# EAGLE design brick_i2c_atomosphere (EAGLE 7.3.0)
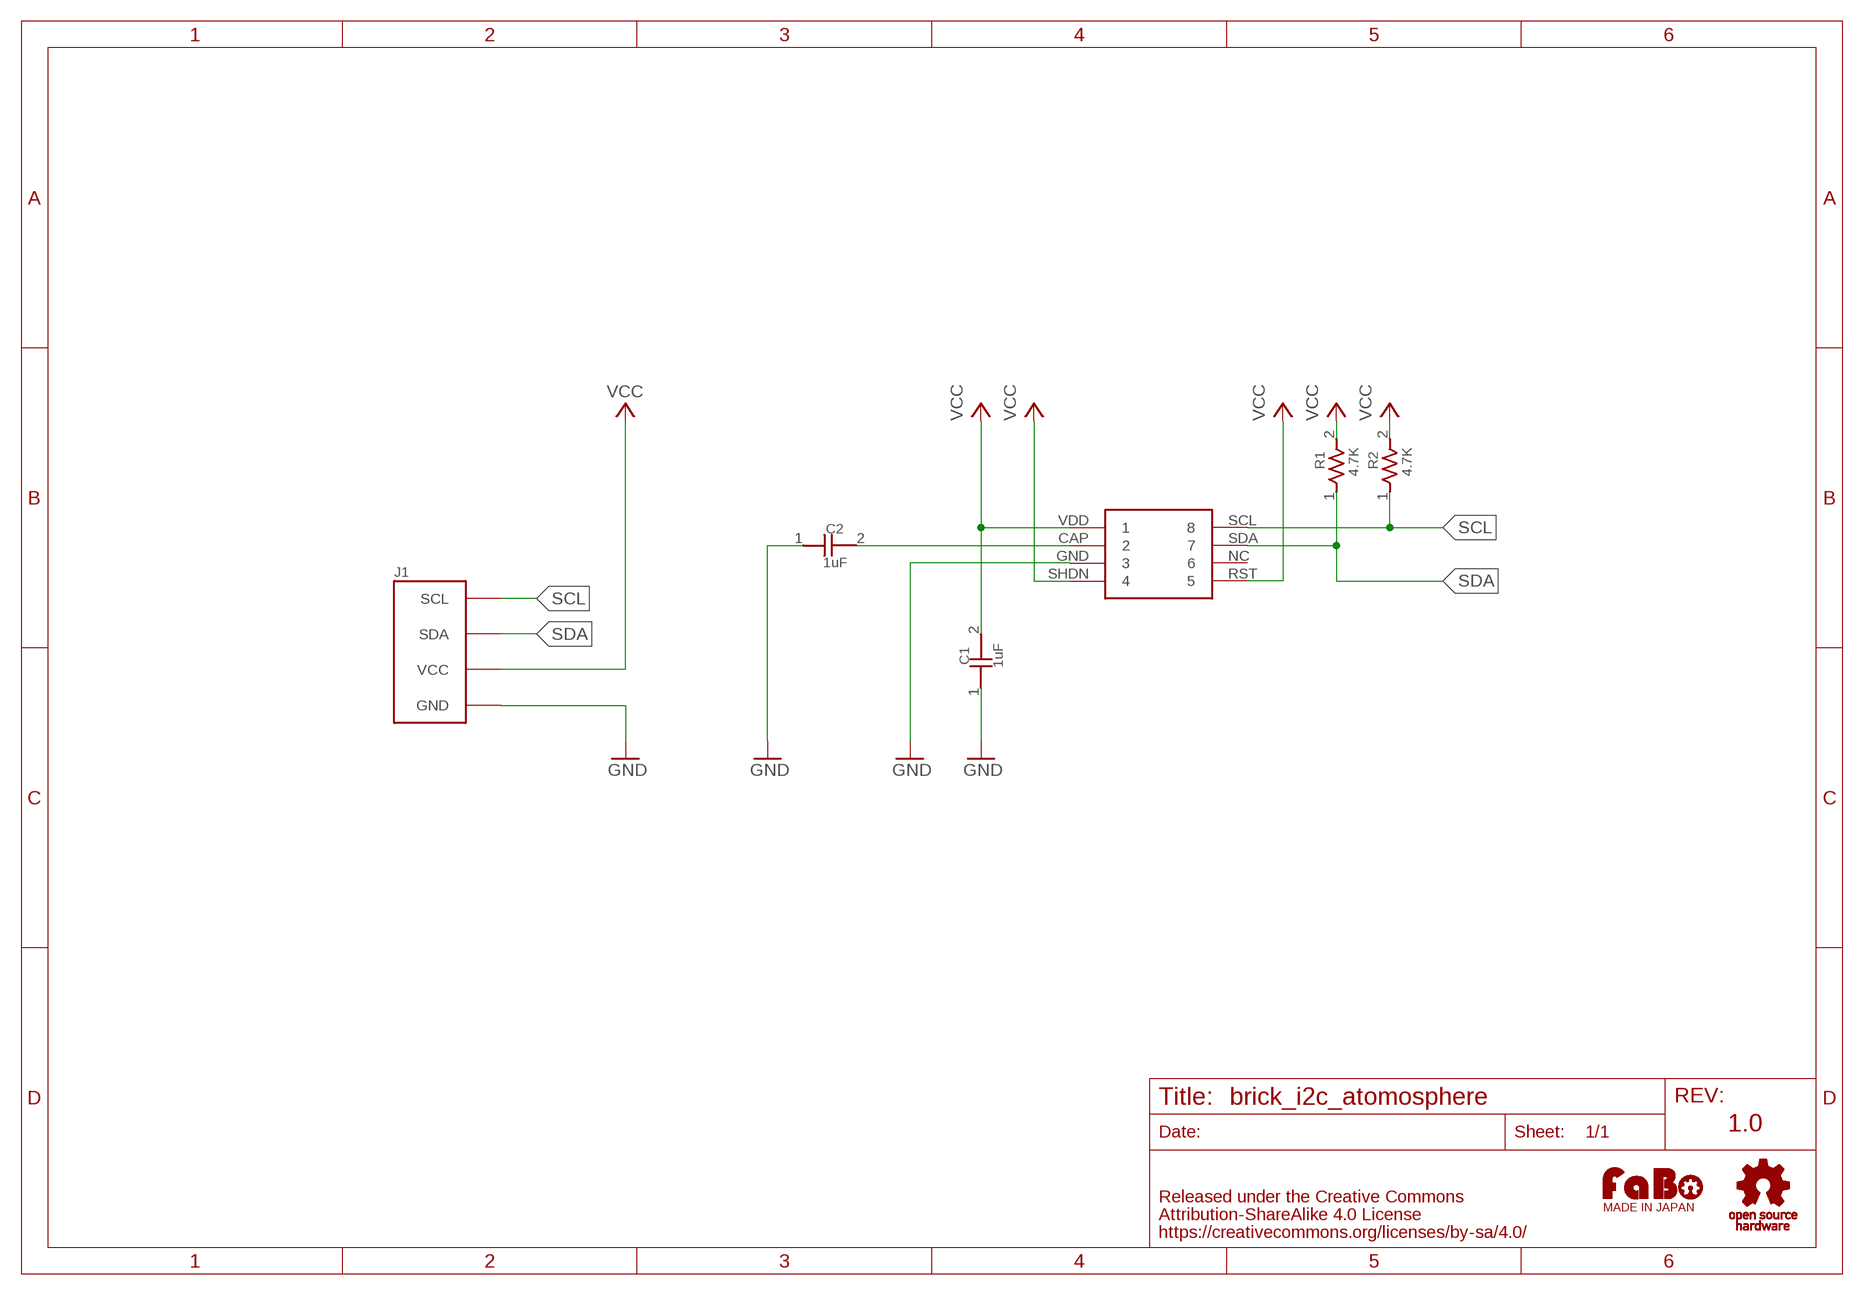
[diagram p0: schematic, sheet 1]

## Parts
C1  1uF  CAPACITOR0603  [0603]
C2  1uF  CAPACITOR0603  [0603]
J1  BRICK_I2C  [BRICK_I2C]
R1  4.7K  RESISTOR0603  [0603]
R2  4.7K  RESISTOR0603  [0603]
U$2  I2C-MPL115A2  [I2C-MLP115A2]
U$3  LOGO_FABO-M  [LOGO_FABO_M]
U$5  LOGO_OSHW_T-M  [LOGO_OSHW_T_M]

## Nets
GND: C1.1 C2.1 J1.GND U$2.GND
N$1: C2.2 U$2.CAP
SCL: J1.SCL R2.1 U$2.SCL
SDA: J1.SDA R1.1 U$2.SDA
VCC: C1.2 J1.VCC R1.2 R2.2 U$2.RST U$2.SHDN U$2.VDD
Unconnected: U$2.NC

## Notes on the sheet
- 1.0

## Library data of the parts
C1 C2 = GClue-Capacitor:CAPACITOR
J1 = gclue:BRICK_I2C: FaBo Brick 4pin(I2C)
R1 R2 = GClue-Resistors:RESISTOR
U$2 = gclue:I2C-MPL115A2
U$3 = FaBo:LOGO_FABO
U$5 = gclue:LOGO_OSHW_T

## Board
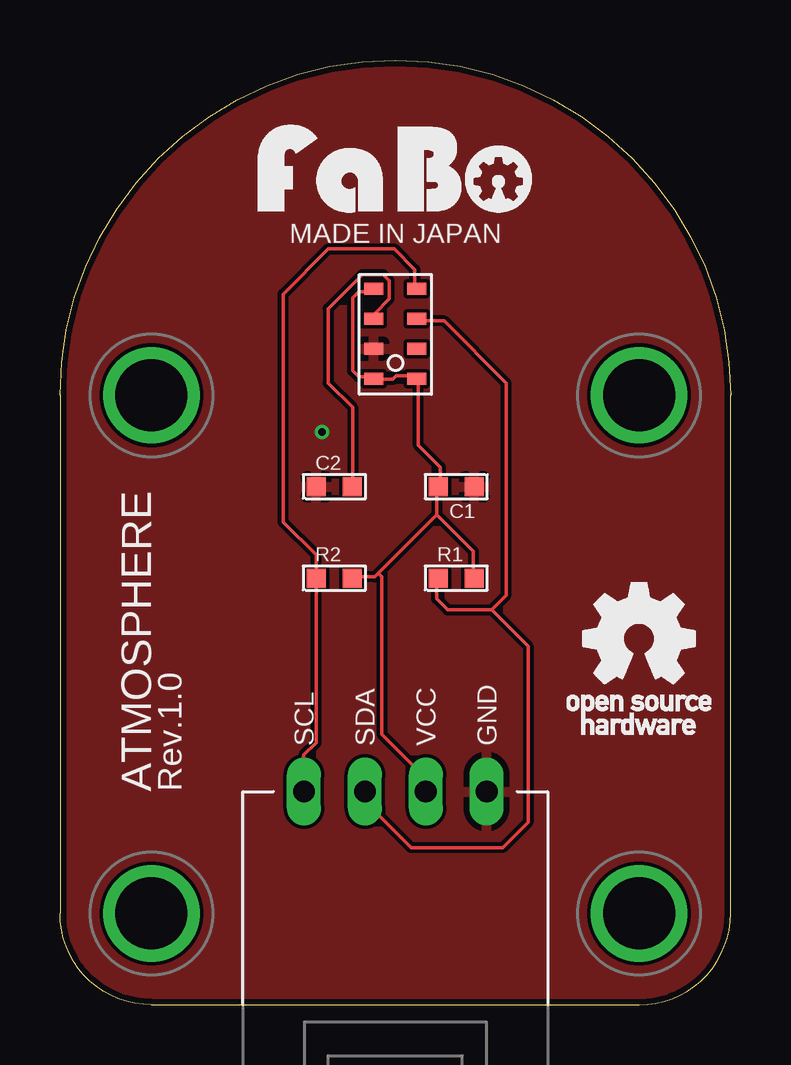
[diagram p1: board, top side]
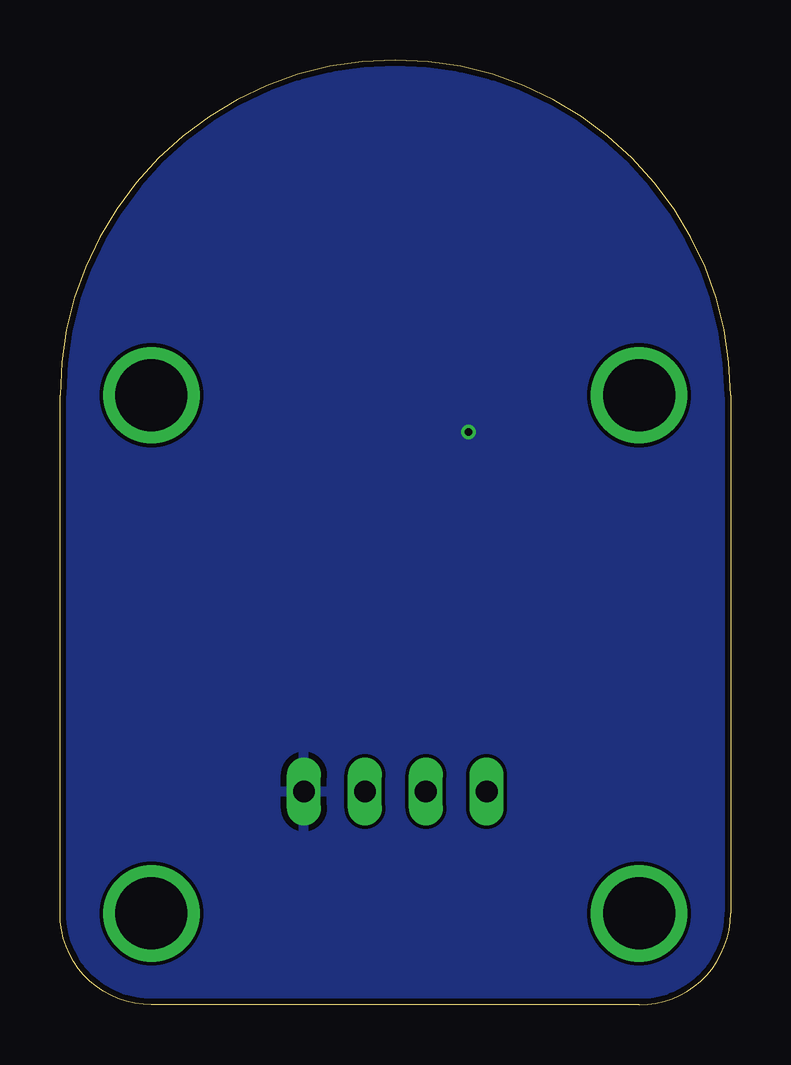
[diagram p2: board, bottom side, seen from below]

Size 27.94 x 39.37 mm. Coordinates in mm from the lower left corner, seen from the top.
Copper layers (1*16): Top 0.035mm / dielectric 1.5mm / Bottom 0.035mm
Design rules "Elecrow_2-layer_eagle_rule": minimum track width 6mil, minimum drill 12mil, track to track 6mil, track to pad 6mil, pad to pad 6mil, via to via 6mil, smd to smd 0mil, copper to edge 10mil, drill to drill 10mil, minimum pad ring 10mil, minimum via ring 6mil, stop-mask expansion 2mil, vias tented up to drill 100mil, thermal gap 10mil

### Footprints (pad centres in the part's own frame; a part is rotated, then mirrored left to right if it is on the bottom)
0603 = smd 0.8 x 0.8: 1 -0.75,0; 2 0.75,0
BRICK_I2C = drill 0.9 long: GND 3.81,-10.16; SCL -3.81,-10.16; SDA -1.27,-10.16; VCC 1.27,-10.16 | drill 3 pad 3.81: P$1 -10.16,6.35; P$2 10.16,6.35; P$3 -10.16,-15.24; P$4 10.16,-15.24
I2C-MLP115A2 = smd 0.8 x 0.5: CAP -0.9,0.65; GND -0.9,-0.6; NC 0.9,-0.6; RST 0.9,-1.85; SCL 0.9,1.9; SDA 0.9,0.65; SHDN -0.9,-1.85; VDD -0.9,1.9

### Placement (x,y rotation side)
C1  16.51,21.59 180 top
C2  11.43,21.59 0 top
J1  13.97,19.05 0 top
R1  16.51,17.78 0 top
R2  11.43,17.78 0 top
U$2  13.97,27.94 0 top
U$3  13.97,33.02 0 top
U$5  24.13,15.24 0 top

### Tracks (layer width: path | path; a pad name or v marks a point on that pad's centre or on a via)
GND  (via drill 0.3)
  other vias: 10.92,23.88
  pour Bottom: -1.27,-1.27 29.21,-1.27 29.21,40.64 -1.27,40.64
  pour Top: -1.27,-1.27 29.21,-1.27 29.21,40.64 -1.27,40.64
N$1
  Top 0.152: C2.2 12.19,21.64 12.19,24.89 11.18,25.91 11.18,29.01 12.6,30.43 13.46,30.43 13.72,30.18 13.72,29.41 13.11,28.8 13.26,28.65 13.11,28.5 U$2.CAP
SCL
  Top 0.152: J1.SCL 10.16,10.41 10.67,10.92 10.67,17.68 R2.1 10.67,17.83 10.67,18.75 9.3,20.12 9.3,29.62 11.18,31.5 13.92,31.5 14.78,30.63 14.78,29.87 U$2.SCL
SDA
  Top 0.152: 17.98,16.46 18.59,17.07 18.59,25.91 16,28.5 14.94,28.5 U$2.SDA | 17.98,16.46 16.15,16.46 15.7,16.92 15.7,17.68 R1.1 | 17.98,16.46 19.51,14.94 19.51,7.62 18.44,6.55 14.63,6.55 12.8,8.38 12.8,8.84 J1.SDA
VCC
  Top 0.152: U$2.VDD 12.95,29.87 12.9,29.87 12.7,29.72 12.45,29.72 12.19,29.46 12.19,26.42 12.45,26.16 12.95,26.16 U$2.SHDN 13.11,26.06 13.87,26.06 14.02,26.21 14.78,26.21 U$2.RST 14.94,26.06 14.94,23.32 15.85,22.4 15.85,21.64 C1.2 15.7,21.49 15.7,20.42 | 15.7,20.42 13.26,17.98 | 13.26,17.98 13.11,17.83 12.19,17.83 R2.2 | 15.7,20.42 17.22,18.9 17.22,17.83 R1.2 | J1.VCC 15.24,9.45 13.41,11.28 13.41,17.83 13.26,17.98

### Text on the board
tPlace: MADE IN JAPAN | ATMOSPHERE | Rev.1.0